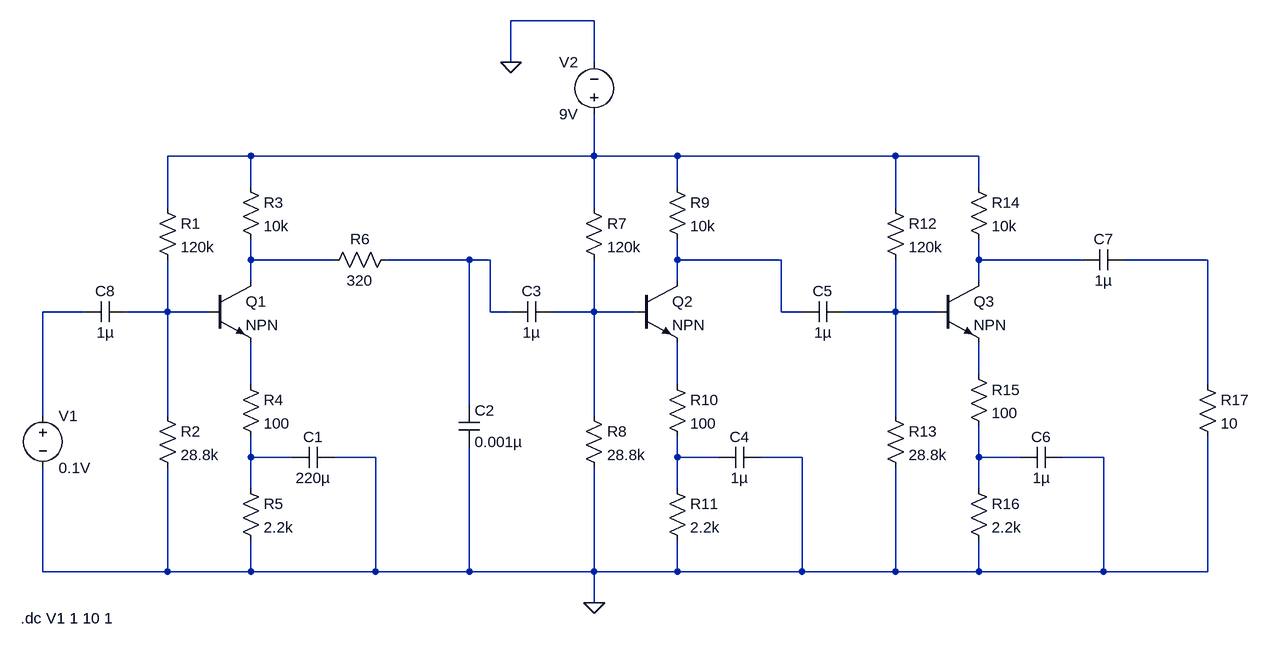
[diagram p0: schematic Draft1.asc]
Draft1.asc, the LTspice schematic file:
Version 4
SHEET 1 1460 680
WIRE -4576 -912 -4704 -912
WIRE -4704 -848 -4704 -912
WIRE -4576 -848 -4576 -912
WIRE -5104 -704 -5232 -704
WIRE -4576 -704 -4576 -768
WIRE -4576 -704 -5104 -704
WIRE -4448 -704 -4576 -704
WIRE -4112 -704 -4448 -704
WIRE -3984 -704 -4112 -704
WIRE -5104 -656 -5104 -704
WIRE -4448 -656 -4448 -704
WIRE -3984 -656 -3984 -704
WIRE -5232 -624 -5232 -704
WIRE -4576 -624 -4576 -704
WIRE -4112 -624 -4112 -704
WIRE -5104 -544 -5104 -576
WIRE -4976 -544 -5104 -544
WIRE -4768 -544 -4896 -544
WIRE -4736 -544 -4768 -544
WIRE -4448 -544 -4448 -576
WIRE -4288 -544 -4448 -544
WIRE -3984 -544 -3984 -576
WIRE -3824 -544 -3984 -544
WIRE -3632 -544 -3760 -544
WIRE -5104 -512 -5104 -544
WIRE -4448 -512 -4448 -544
WIRE -3984 -512 -3984 -544
WIRE -5360 -464 -5424 -464
WIRE -5232 -464 -5232 -544
WIRE -5232 -464 -5296 -464
WIRE -5168 -464 -5232 -464
WIRE -4736 -464 -4736 -544
WIRE -4704 -464 -4736 -464
WIRE -4576 -464 -4576 -544
WIRE -4576 -464 -4640 -464
WIRE -4512 -464 -4576 -464
WIRE -4288 -464 -4288 -544
WIRE -4256 -464 -4288 -464
WIRE -4112 -464 -4112 -544
WIRE -4112 -464 -4192 -464
WIRE -4048 -464 -4112 -464
WIRE -3984 -368 -3984 -416
WIRE -5104 -352 -5104 -416
WIRE -4448 -352 -4448 -416
WIRE -3632 -352 -3632 -544
WIRE -4768 -320 -4768 -544
WIRE -5424 -304 -5424 -464
WIRE -5232 -304 -5232 -464
WIRE -4576 -304 -4576 -464
WIRE -4112 -304 -4112 -464
WIRE -5104 -240 -5104 -272
WIRE -5040 -240 -5104 -240
WIRE -4912 -240 -4976 -240
WIRE -4448 -240 -4448 -272
WIRE -4384 -240 -4448 -240
WIRE -4256 -240 -4320 -240
WIRE -3984 -240 -3984 -288
WIRE -3920 -240 -3984 -240
WIRE -3792 -240 -3856 -240
WIRE -5104 -192 -5104 -240
WIRE -4448 -192 -4448 -240
WIRE -3984 -192 -3984 -240
WIRE -5424 -64 -5424 -224
WIRE -5232 -64 -5232 -224
WIRE -5232 -64 -5424 -64
WIRE -5104 -64 -5104 -112
WIRE -5104 -64 -5232 -64
WIRE -4912 -64 -4912 -240
WIRE -4912 -64 -5104 -64
WIRE -4768 -64 -4768 -256
WIRE -4768 -64 -4912 -64
WIRE -4576 -64 -4576 -224
WIRE -4576 -64 -4768 -64
WIRE -4448 -64 -4448 -112
WIRE -4448 -64 -4576 -64
WIRE -4256 -64 -4256 -240
WIRE -4256 -64 -4448 -64
WIRE -4112 -64 -4112 -224
WIRE -4112 -64 -4256 -64
WIRE -3984 -64 -3984 -112
WIRE -3984 -64 -4112 -64
WIRE -3792 -64 -3792 -240
WIRE -3792 -64 -3984 -64
WIRE -3632 -64 -3632 -272
WIRE -3632 -64 -3792 -64
WIRE -4576 -16 -4576 -64
FLAG -4704 -848 0
FLAG -4576 -16 0
SYMBOL res -5248 -640 R0
SYMATTR InstName R1
SYMATTR Value 120k
SYMBOL res -5248 -320 R0
SYMATTR InstName R2
SYMATTR Value 28.8k
SYMBOL res -5120 -672 R0
SYMATTR InstName R3
SYMATTR Value 10k
SYMBOL res -5120 -368 R0
SYMATTR InstName R4
SYMATTR Value 100
SYMBOL res -5120 -208 R0
SYMATTR InstName R5
SYMATTR Value 2.2k
SYMBOL npn -5168 -512 R0
SYMATTR InstName Q1
SYMBOL cap -4976 -256 R90
WINDOW 0 0 32 VBottom 2
WINDOW 3 32 32 VTop 2
SYMATTR InstName C1
SYMATTR Value 220µ
SYMBOL res -4880 -560 R90
WINDOW 0 0 56 VBottom 2
WINDOW 3 32 56 VTop 2
SYMATTR InstName R6
SYMATTR Value 320
SYMBOL cap -4784 -320 R0
SYMATTR InstName C2
SYMATTR Value 0.001µ
SYMBOL cap -4640 -480 R90
WINDOW 0 0 32 VBottom 2
WINDOW 3 32 32 VTop 2
SYMATTR InstName C3
SYMATTR Value 1µ
SYMBOL res -4592 -640 R0
SYMATTR InstName R7
SYMATTR Value 120k
SYMBOL res -4592 -320 R0
SYMATTR InstName R8
SYMATTR Value 28.8k
SYMBOL res -4464 -672 R0
SYMATTR InstName R9
SYMATTR Value 10k
SYMBOL res -4464 -368 R0
SYMATTR InstName R10
SYMATTR Value 100
SYMBOL res -4464 -208 R0
SYMATTR InstName R11
SYMATTR Value 2.2k
SYMBOL npn -4512 -512 R0
SYMATTR InstName Q2
SYMBOL cap -4320 -256 R90
WINDOW 0 0 32 VBottom 2
WINDOW 3 32 32 VTop 2
SYMATTR InstName C4
SYMATTR Value 1µ
SYMBOL cap -4192 -480 R90
WINDOW 0 0 32 VBottom 2
WINDOW 3 32 32 VTop 2
SYMATTR InstName C5
SYMATTR Value 1µ
SYMBOL res -4128 -640 R0
SYMATTR InstName R12
SYMATTR Value 120k
SYMBOL res -4128 -320 R0
SYMATTR InstName R13
SYMATTR Value 28.8k
SYMBOL res -4000 -672 R0
SYMATTR InstName R14
SYMATTR Value 10k
SYMBOL res -4000 -384 R0
SYMATTR InstName R15
SYMATTR Value 100
SYMBOL res -4000 -208 R0
SYMATTR InstName R16
SYMATTR Value 2.2k
SYMBOL npn -4048 -512 R0
SYMATTR InstName Q3
SYMBOL cap -3856 -256 R90
WINDOW 0 0 32 VBottom 2
WINDOW 3 32 32 VTop 2
SYMATTR InstName C6
SYMATTR Value 1µ
SYMBOL cap -3760 -560 R90
WINDOW 0 0 32 VBottom 2
WINDOW 3 32 32 VTop 2
SYMATTR InstName C7
SYMATTR Value 1µ
SYMBOL res -3648 -368 R0
SYMATTR InstName R17
SYMATTR Value 10
SYMBOL cap -5296 -480 R90
WINDOW 0 0 32 VBottom 2
WINDOW 3 32 32 VTop 2
SYMATTR InstName C8
SYMATTR Value 1µ
SYMBOL voltage -5424 -320 R0
WINDOW 123 0 0 Left 2
WINDOW 39 0 0 Left 2
SYMATTR InstName V1
SYMATTR Value 0.1V
SYMBOL voltage -4576 -752 R180
WINDOW 0 24 96 Left 2
WINDOW 3 24 16 Left 2
SYMATTR InstName V2
SYMATTR Value 9V
TEXT -5458 8 Left 2 !.dc V1 1 10 1

The netlist it stands for:
* Draft1.asc
R1 N001 N008 120k
R2 N008 0 28.8k
R3 N001 N002 10k
R4 N012 N014 100
R5 N014 0 2.2k
Q1 N002 N008 N012 0 NPN
C1 0 N014 220µ
R6 N003 N002 320
C2 N003 0 0.001µ
C3 N009 N003 1µ
R7 N001 N009 120k
R8 N009 0 28.8k
R9 N001 N004 10k
R10 N013 N015 100
R11 N015 0 2.2k
Q2 N004 N009 N013 0 NPN
C4 0 N015 1µ
C5 N010 N004 1µ
R12 N001 N010 120k
R13 N010 0 28.8k
R14 N001 N005 10k
R15 N011 N016 100
R16 N016 0 2.2k
Q3 N005 N010 N011 0 NPN
C6 0 N016 1µ
C7 N006 N005 1µ
R17 N006 0 10
C8 N008 N007 1µ
V1 N007 0 0.1V
V2 N001 0 9V
.model NPN NPN
.model PNP PNP
.lib standard.bjt
.dc V1 1 10 1
.backanno
.end